# EasyEDA schematic SCH_E-nose-Design_2025-10-13.json
TITLE: Sheet_1; REV: 1.0; Date: 2025-10-01; Sheet: 1/1; Drawn By: ee220002082; Company: Your Company
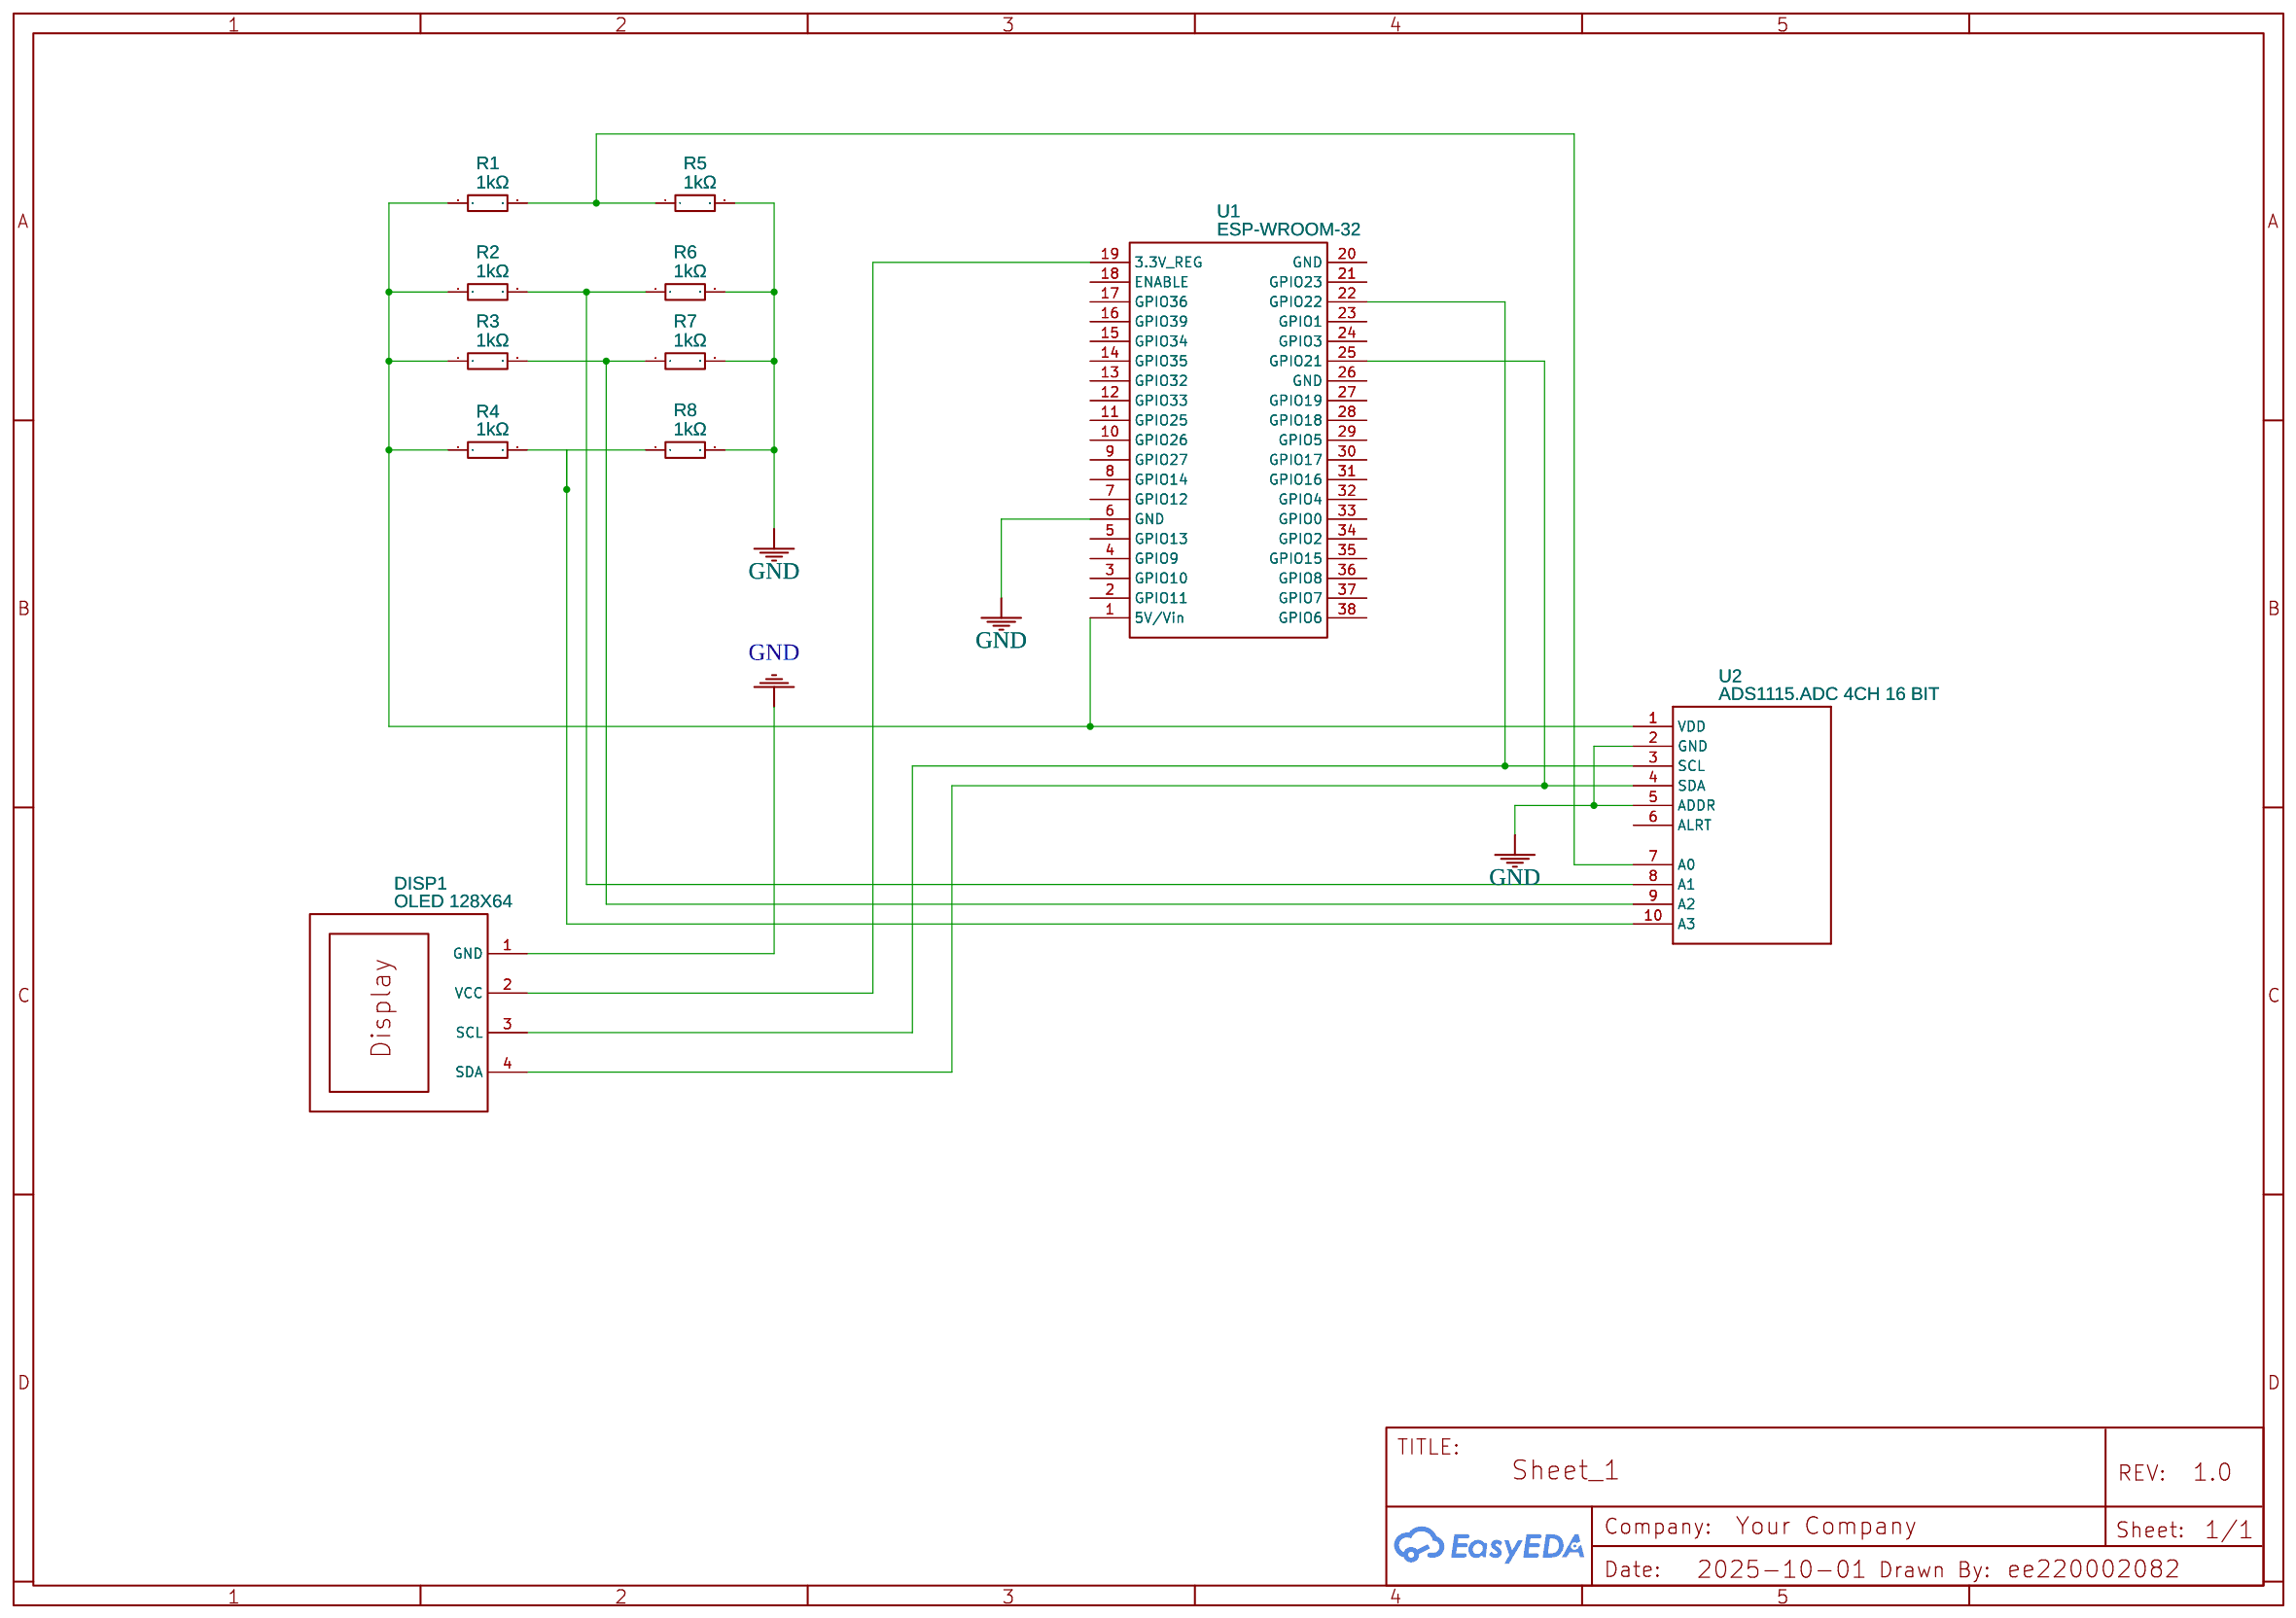
[diagram p0: schematic sheet]

## Parts
DISP1  OLED 128X64  [0.96OLED_4P_ONLY_PINS]
R1  1kΩ  [R1206]
R2  1kΩ  [R1206]
R3  1kΩ  [R1206]
R4  1kΩ  [R1206]
R5  1kΩ  [R1206]
R6  1kΩ  [R1206]
R7  1kΩ  [R1206]
R8  1kΩ  [R1206]
U1  ESP-WROOM-32  [ESP32]
U2  ADS1115.ADC 4CH 16 BIT  [ADC-4CH-ADS1115]

## Library data of the parts
DISP1 = OLED 128X64: Contributor: vissos; sourceId: hdI0icuoG
R1-R8 = RC1206JR-071KL: Supplier: LCSC; Manufacturer: YAGEO(国巨); Supplier Part: C112223; JLCPCB Part Class: Extended Part
U1 = ESP-WROOM-32: Supplier: Amazon; link: https://www.amazon.com/dp/B0718T232Z; Contributor: amsmith1109
U2 = ADS1115.ADC 4CH 16 BIT: 4 Channel 16-Bit Analog-to-Digital Converter based on ADS1115 chip; Contributor: amocachi

## Nets
GND: DISP1.1(GND) R5.2 R6.2 R7.2 R8.2 U1.6(GND) U2.2(GND) U2.5(ADDR)
Net-(DISP1-2): DISP1.2(VCC) U1.19(3.3V REG)
Net-(DISP1-3): DISP1.3(SCL) U1.22(GPIO22) U2.3(SCL)
Net-(DISP1-4): DISP1.4(SDA) U1.25(GPIO21) U2.4(SDA)
Net-(R1-1): R1.1 R2.1 R3.1 R4.1 U1.1(5V/Vin) U2.1(VDD)
Net-(R1-2): R1.2 R5.1 U2.7(A0)
Net-(R2-2): R2.2 R6.1 U2.8(A1)
Net-(R3-2): R3.2 R7.1 U2.9(A2)
Net-(R4-2): R4.2 R8.1 U2.10(A3)

Not connected (* = marked no-connect by the designer): U1 2(GPIO11) 3(GPIO10) 4(GPIO9) 5(GPIO13) 7(GPIO12) 8(GPIO14) 9(GPIO27) 10(GPIO26) 11(GPIO25) 12(GPIO33) 13(GPIO32) 14(GPIO35) 15(GPIO34) 16(GPIO39) 17(GPIO36) 18(ENABLE) 20(GND) 21(GPIO23) 23(GPIO1) 24(GPIO3) 26(GND) 27(GPIO19) 28(GPIO18) 29(GPIO5) 30(GPIO17) 31(GPIO16) 32(GPIO4) 33(GPIO0) 34(GPIO2) 35(GPIO15) 36(GPIO8) 37(GPIO7) 38(GPIO6); U2 6(ALRT)
